# Altium project Bat_Detector.PrjPcb
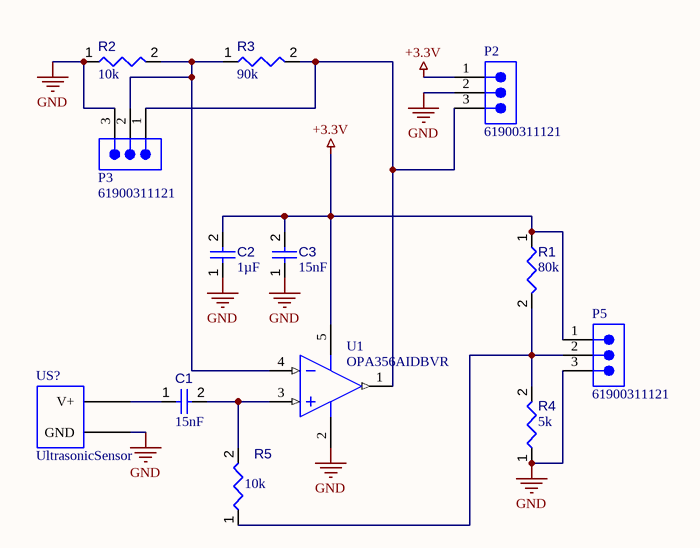
[diagram p0: Bat_Detector_Sheet.SchDoc]
1 sheet, 13 parts. Net scope: global (net labels, ports and power ports of the same name join across sheets).
Board file: Bat_Detector_PCB.PcbDoc

## Sheet Bat_Detector_Sheet.SchDoc
size A4; SheetNumber: 1; SheetTotal: 1

### Parts
C1  value 15nF  [CAPC0805(2012)145_L]  (hidden comment: Capacitor 4.7µF +/-40% 25V 0805)
C2  value 1µF  [CAPC0805(2012)145_L]  (hidden comment: Capacitor 4.7µF +/-40% 25V 0805)
C3  value 15nF  [CAPC0805(2012)145_L]  (hidden comment: Capacitor 4.7µF +/-40% 25V 0805)
P2  61900311121  [61900311121]
P3  61900311121  [61900311121]
P5  61900311121  [61900311121]
R1  value 80k  [RESC0805(2012)_L]  (hidden comment: Resistor 1K +/-5% 0805 125 mW)
R2  value 10k  [RESC0805(2012)_L]  (hidden comment: Resistor 1K +/-5% 0805 125 mW)
R3  value 90k  [RESC0805(2012)_L]  (hidden comment: Resistor 1K +/-5% 0805 125 mW)
R4  value 5k  [RESC0805(2012)_L]  (hidden comment: Resistor 1K +/-5% 0805 125 mW)
R5  value 10k  [RESC0805(2012)_L]  (hidden comment: Resistor 1K +/-5% 0805 125 mW)
U1  OPA356AIDBVR  [DBV0005A_M]
US?  UltrasonicSensor  [RESMELF110150N]

### Nets
+3.3V: C2.2 C3.2 P2.1 P5.1 R1.1 U1.5(V+)
GND: C2.1 C3.1 P2.2 P3.3 P5.3 R2.1 R4.1 U1.2(V-) US?.1(GND)
NetC1_1: C1.1 US?.0(V+)
NetC1_2: C1.2 R5.2 U1.3(IN+)
NetP2_3: P2.3 P3.1 R3.2 U1.1(OUT)
NetP3_2: P3.2 R2.2 R3.1 U1.4(IN-)
NetP5_2: P5.2 R1.2 R4.2 R5.1

### Library data of the parts
C1-C3 = CMP-001-00080-4: Chip Capacitor, 4.7µF +/-40%, 25V, 0805, Thickness 1.45 mm; Tolerance: 20%; Voltage Rating: 25V; Min Operating Temperature: -55°C; Max Operating Temperature: 85°C; Pins: 2; Mounting Technology: SMT; Case/Package: 0805
P2 P3 P5 = CMP-1502-00585-2: NexarPartId: 18818222; Current Rating: 3A; Voltage Rating: 250V; Number of Positions: 3; Insulation Resistance: 1GΩ; Gender: Male; Pitch: 2.54mm; Connector Type: Male Pin; Contact Resistance: 20mΩ; Termination: Through Hole; Width: 7.66mm; Contact Plating: Tin; Orientation: Vertical; Mount: Through Hole; Contact Gender: Male; Max Operating Temperature: 105°C; Length: 7.62mm; Number of Rows: 1; Height: 12.5mm; Lead Pitch: 2.54mm; Housing Material: Nylon; Color: Beige; Contact Material: Copper; Fastening Type: Friction; Min Operating Temperature: -40°C; Number of Contacts: 3; Number of Pins: 3; Flammability Rating: UL94 V-0; Contact Mating Length: 7.493mm; RoHS: Compliant; REACH SVHC: Unknown; Packaging: Bulk; Operating Supply Voltage: 250V
R1-R5 = CMP-009-00118-3: Chip Resistor, 1 kOhms, +/-5%, 125 mW, -55 to 155 degC, 0805; Tolerance: 5%; Power: 125mW; Case/Package: 0805; Pins: 2; Min Operating Temperature: -55°C; Max Operating Temperature: 155°C
U1 = CMP-0016-00070-2: 200 MHz GBW, CMOS Single Operational Amplifier, 2.5 to 5.5 V, -40 to 125 degC, 5-pin SOT23 (DBV5), Green (RoHS & no Sb/Br); Manufacturer: Texas Instruments; Settling Time (0.1%)(Typ)(ns): 30; Acl, min stable gain(V/V): 1; Sub Family: High Output Current Amplifier (>=50mA), High Speed Amplifier (>=50MHz), Low Supply Voltage Amplifier (<=2.7V); Vs(Max)(V): 5.5; Diff Phase(deg): 0.05; Diff Gain(%): 0.02; THD (Fc is 1 MHz)(Typ)(dB): -79; 3rd Harmonic(dBc): 93; Io(Typ)(mA): 100; Iq per channel(Max)(mA): 14; Vn at Flatband(Typ)(nV/rtHz): 5.8; 2nd Harmonic(dBc): 81; BW @ Acl(MHz): 450; Rail-Rail: Out; Vio(Max)(mV): 9; Vs(Min)(V): 2.5; Slew Rate(Typ)(V/us): 360; ComponentLink2URL: http://www.ti.com/general/docs/lit/getliterature.tsp?genericPartNumber=OPA356&fileType=pdf; PartNumber: OPA356AIDBVR; PackageDescription: 5-Pin Plastic Small Outline, Body 1.6 x 2.9 mm, Pitch 0.95 mm; ComponentLink2Description: Datasheet; PackageReference: DBV0005A; Number of Channels: 1; ComponentLink1URL: http://www.ti.com/; Iib(Max)(nA): 0.05; ComponentLink3URL: http://www.ti.com/litv/pdf/mpds018i; DatasheetVersion: SBOS212A; Eco-Plan: Green (RoHS & no Sb/Br); Mounting Technology: Surface Mount; Code_JEDEC: MO-178; @ MHz: 1; PackageVersion: 4073253-4/K, 03/2006; ComponentLink3Description: Package Specification; ComponentLink1Description: Manufacturer URL
US? = UltrasonicSensor: A simple ultrasonic sensor HC-SR04